# Altium schematic sheet tank_control.SchDoc
size A
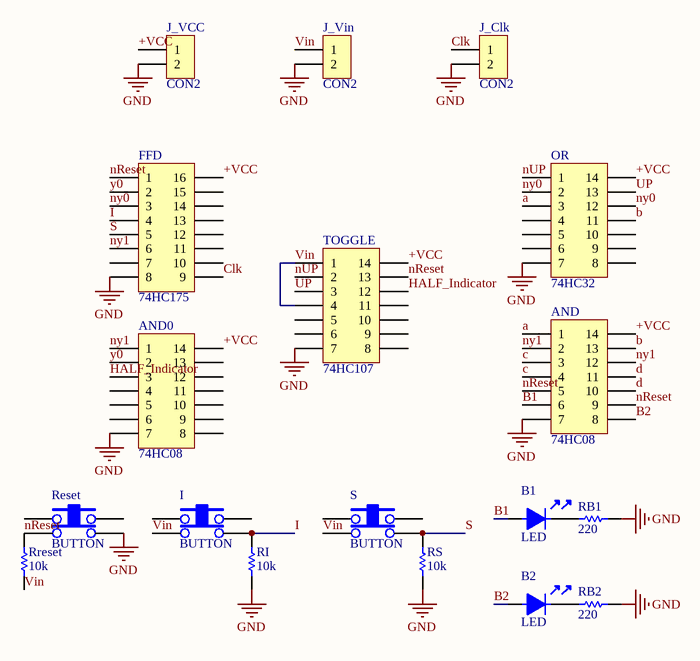
[diagram p0: tank_control.SchDoc]

## Parts
AND  74HC08  [DIP14]
AND0  74HC08  [DIP14]
B1  LED  [LED3]
B2  LED  [LED3]
FFD  74HC175  [DIP16]
I  BUTTON  [TACTSWITCH]
J_Clk  CON2  [SIP2]
J_VCC  CON2  [SIP2]
J_Vin  CON2  [SIP2]
OR  74HC32  [DIP14]
RB1  220  [RES400]
RB2  220  [RES400]
Reset  BUTTON  [TACTSWITCH]
RI  10k  [RES400]
Rreset  10k  [RES400]
RS  10k  [RES400]
S  BUTTON  [TACTSWITCH]
TOGGLE  74HC107  [DIP14]

## Nets
GND: AND.7 AND0.7 FFD.8 J_Clk.2 J_VCC.2 J_Vin.2 OR.7 RB1.1 RB2.1 Reset.4 RI.1 RS.1 TOGGLE.7
+VCC: AND.14 AND0.14 FFD.16 J_VCC.1 OR.14 TOGGLE.14
a: AND.1 OR.3
b: AND.13 OR.11
B1: AND.6 B1.1
B2: AND.8 B2.1
c: AND.3 AND.4
Clk: FFD.9 J_Clk.1
d: AND.10 AND.11
HALF_Indicator: AND0.3 TOGGLE.12
I: FFD.4 I.4 RI.2
nReset: AND.5 AND.9 FFD.1 Reset.2 Rreset.2 TOGGLE.13
nUP: OR.1 TOGGLE.2
ny0: FFD.3 OR.2 OR.12
ny1: AND.2 AND.12 AND0.1 FFD.6
S: FFD.5 RS.2 S.4
UP: OR.13 TOGGLE.3
Vin: I.2 J_Vin.1 Rreset.1 S.2 TOGGLE.1 TOGGLE.4
y0: AND0.2 FFD.2
NetB1_2: B1.2 RB1.2
NetB2_2: B2.2 RB2.2

Not connected (* = marked no-connect by the designer): AND0 4 5 6 8 9 10 11 12 13; FFD 7 10 11 12 13 14 15; I 1 3; OR 4 5 6 8 9 10; Reset 1 3; S 1 3; TOGGLE 5 6 8 9 10 11

## Library data of the parts
AND AND0 OR TOGGLE = IC_DIP14
FFD = IC_DIP16
I Reset S = TACT SWITCH
RB1 RB2 RI Rreset RS = RES